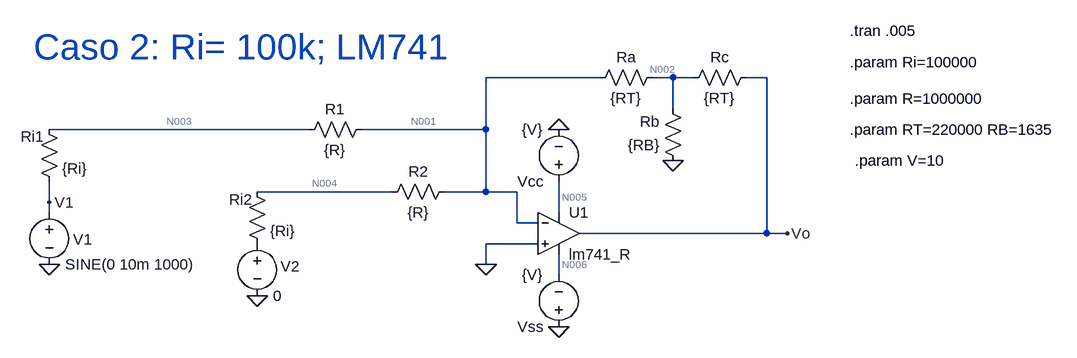
[diagram p0: schematic Caso 1.2 - LM741.asc]
* Caso 1.2 - LM741.asc
R1 N001 N003 {R}
R2 N001 N004 {R}
V1 V1 0 SINE(0 10m 1000)
V2 P001 0 0
Vss 0 N006 {V}
Vcc N005 0 {V}
Ri1 N003 V1 {Ri}
Ri2 N004 P001 {Ri}
Ra N002 N001 {RT}
Rc Vo N002 {RT}
Rb 0 N002 {RB}
* U1: lm741_R (symbol ZZZ\OpAmp\lm741_R not available, pins judged from their places): In+=0 In-=N001 V+=N005 V-=N006 OUT=Vo
.tran .005
.param Ri=100000
.param R=1000000
.param RT=220000 RB=1635
.param V=10
* Caso 2: Ri= 100k; LM741
.backanno
.end

* Results of the author's LTspice run, read from the files saved beside the schematic
* Operating Point, zero values left out:
*   V(n001) = 215 µV
*   V(n003) = 19.54 µV
*   V(n004) = 19.54 µV
*   V(n006) = -10 V
*   V(n005) = 10 V
*   V(n002) = 8.886 mV
*   V(vo) = 1.213 V
*   I(R1) = 195.4 pA
*   I(R2) = 195.4 pA
*   I(Ri1) = 195.4 pA
*   I(Ri2) = 195.4 pA
*   I(Ra) = 39.41 nA
*   I(Rc) = 5.474 µA
*   I(Rb) = -5.435 µA
*   I(V1) = 195.4 pA
*   I(V2) = 195.4 pA
*   I(Vss) = -996.7 µA
*   I(Vcc) = -1.002 mA
*   Ix(u1:IN+) = 38.88 nA
*   Ix(u1:IN-) = 39.02 nA
*   Ix(u1:VCC) = 1.002 mA
*   Ix(u1:VSS) = -996.7 µA
*   Ix(u1:OUT) = -5.474 µA
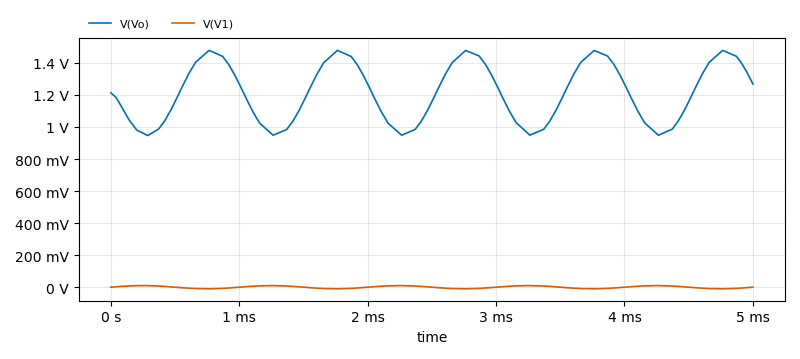
[diagram p1: Transient Analysis of Caso 1.2 - LM741.asc, plotted from the saved traces]
* Transient Analysis, 1 run:
*   V(Vo): min 946.6 mV, max 1.478 V, average 1.213 V, rms 1.227 V, last 1.269 V
*   V(V1): min -9.957 mV, max 9.953 mV, average 4.156 µV, rms 6.939 mV, last 0 V